# Altium schematic sheet 3.0V_regulator.SchDoc: 3.0V digital power supply
size A4; Author: L. Sartory; Organization: L. Sartory; Address2: Nixie clock; Address3: with GPS synchronization; DocumentNumber: 12; Revision: A1; SheetNumber: 12; SheetTotal: 14
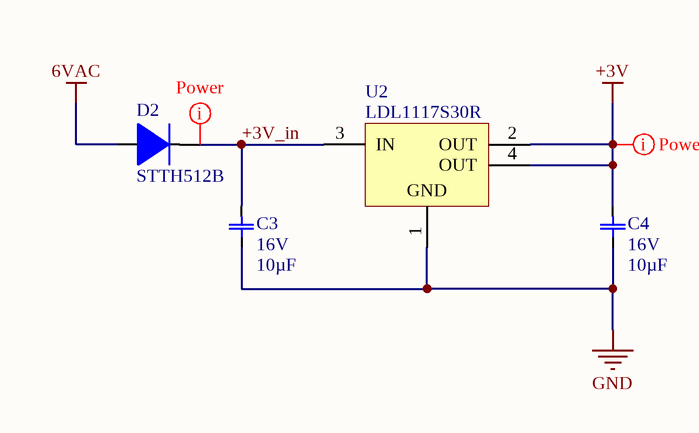
[diagram p0: 3.0V_regulator.SchDoc]

## Parts
C3  Voltage: 16V  [MLCC_1210]  (hidden comment: 10µF)
C4  Voltage: 16V  [MLCC_1210]  (hidden comment: 10µF)
D2  STTH512B  [STTH512B]
U2  LDL1117S30R  [TLV1117]

## Nets
6VAC: D2.A
+3V: C4.2 U2.2(OUT) U2.4(OUT)
GND: C3.1 C4.1 U2.1(GND)
+3V_in: C3.2 D2.K U2.3(IN)

## Layout directives
net class Power: +3V, +3V_in

## Notes on the sheet
- Title
- Size:
- Date:
- A4
- Number:
- Time:
- Revision:
- Sheet
- of
- File:

## Library data of the parts
C3 C4 = MLCC 10µF 16V 1210: Value: 10µF
D2 = STTH512B: Ultrafast recovery - 1200 V diode; HelpURL: https://datasheet.ciiva.com/6374/cd00096465-6374991.pdf
U2 = LDL1117S30R: Fixed LDO Voltage Regulator, 2.6 V to 18 V input, 75 mV Dropout, 3 V / 1.2 A out, SOT-223-4; PartNumber: TLV1117LV12DCYT; Manufacturer: Texas Instruments; Fixed Output Options(V): 1.2; Vdo(Typ)(mV): 1200; SubFamily: Single Channel LDO; Vin(Min)(V): 2; Vin(Max)(V): 5.5; Eco-Plan: Green (RoHS & no Sb/Br); Iout(Max)(A): 1; Iq(Typ)(mA): 0.05; PackageVersion: 4202506/B; ComponentLink2URL: http://www.ti.com/general/docs/lit/getliterature.tsp?genericPartNumber=TLV1117LV12&fileType=pdf; ComponentLink2Description: Datasheet; ComponentLink3Description: Package Specification; Vout Adj(Max)(V): 1.2; ComponentLink1Description: Manufacturer URL; DatasheetVersion: SBVS160A; PackageDescription: 4-Pin Plastic Small Outline, Body 3.5 x 6.5 mm, Pitch 2.3 mm; ComponentLink1URL: http://www.ti.com/; PackageReference: DCY0004A; Code_JEDEC: TO-261; Accuracy(%): 2; Mounting Technology: Surface Mount; Vout Adj(Min)(V): 1.2; ComponentLink3URL: http://www.ti.com/litv/pdf/mpds094a